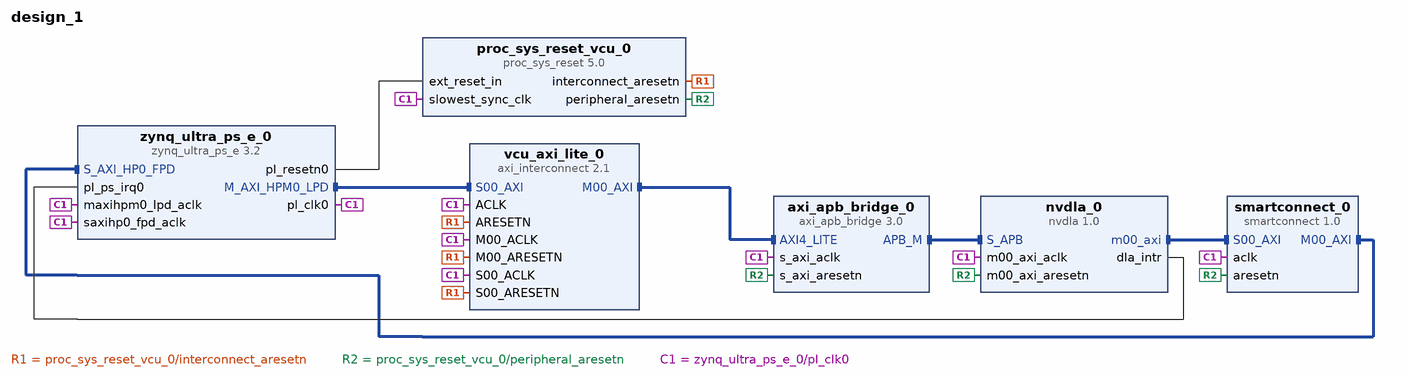
[diagram p0: block diagram of the top level]
# Vivado block design design_1, xczu7ev-ffvc1156-2-e, Vivado 2018.2
create_bd_design design_1

create_bd_cell -type ip -vlnv xilinx.com:ip:zynq_ultra_ps_e:3.2 zynq_ultra_ps_e_0
set_property -dict [list \
  CONFIG.PSU__I2C0__PERIPHERAL__ENABLE 1 \
  CONFIG.PSU__I2C0__PERIPHERAL__IO {MIO 2 .. 3} \
  CONFIG.PSU__SD0__PERIPHERAL__ENABLE 1 \
  CONFIG.PSU__SD0__PERIPHERAL__IO {MIO 13 .. 22} \
  CONFIG.PSU__SD0__SLOT_TYPE {SD 3.0} \
  CONFIG.PSU__SD0__DATA_TRANSFER_MODE 8Bit \
  CONFIG.PSU__UART0__BAUD_RATE 115200 \
  CONFIG.PSU__UART0__PERIPHERAL__ENABLE 1 \
  CONFIG.PSU__UART0__PERIPHERAL__IO {MIO 6 .. 7} \
  CONFIG.PSU__UART0__MODEM__ENABLE 0 \
  CONFIG.PSU__USE__S_AXI_GP2 1 \
  CONFIG.PSU__USE__IRQ0 1 \
  CONFIG.PSU__DDR_HIGH_ADDRESS_GUI_ENABLE 0 \
  CONFIG.PSU__DLL__ISUSED 1 \
] [get_bd_cells zynq_ultra_ps_e_0]
# 41 more settings of zynq_ultra_ps_e_0 are not shown: defaults, MIO pin electricals, DDR timing, and values the tool derives
create_bd_cell -type ip -vlnv xilinx.com:ip:axi_apb_bridge:3.0 axi_apb_bridge_0
set_property -dict {CONFIG.C_M_APB_PROTOCOL apb4 CONFIG.C_APB_NUM_SLAVES 1} [get_bd_cells axi_apb_bridge_0]
create_bd_cell -type ip -vlnv xilinx.com:ip:proc_sys_reset:5.0 proc_sys_reset_vcu_0
create_bd_cell -type ip -vlnv xilinx.com:ip:axi_interconnect:2.1 vcu_axi_lite_0
set_property -dict {CONFIG.NUM_MI 1} [get_bd_cells vcu_axi_lite_0]
create_bd_cell -type ip -vlnv user.org:user:nvdla:1.0 nvdla_0
set_property -dict {CONFIG.C_M00_AXI_BURST_LEN 16 CONFIG.C_M00_AXI_ID_WIDTH 1} [get_bd_cells nvdla_0]
create_bd_cell -type ip -vlnv xilinx.com:ip:smartconnect:1.0 smartconnect_0

# ---- connections ----

connect_bd_intf_net -intf_net axi_lite_2_zynq [get_bd_intf_pins zynq_ultra_ps_e_0/M_AXI_HPM0_LPD] [get_bd_intf_pins vcu_axi_lite_0/S00_AXI]
connect_bd_intf_net [get_bd_intf_pins vcu_axi_lite_0/M00_AXI] [get_bd_intf_pins axi_apb_bridge_0/AXI4_LITE]
connect_bd_intf_net [get_bd_intf_pins axi_apb_bridge_0/APB_M] [get_bd_intf_pins nvdla_0/S_APB]
connect_bd_intf_net [get_bd_intf_pins nvdla_0/m00_axi] [get_bd_intf_pins smartconnect_0/S00_AXI]
connect_bd_intf_net [get_bd_intf_pins smartconnect_0/M00_AXI] [get_bd_intf_pins zynq_ultra_ps_e_0/S_AXI_HP0_FPD]
connect_bd_net -net pl_reset_axi [get_bd_pins zynq_ultra_ps_e_0/pl_resetn0] [get_bd_pins proc_sys_reset_vcu_0/ext_reset_in]
connect_bd_net -net axi_lite_reset_10 [get_bd_pins proc_sys_reset_vcu_0/interconnect_aresetn] \
  [get_bd_pins vcu_axi_lite_0/ARESETN] [get_bd_pins vcu_axi_lite_0/S00_ARESETN] [get_bd_pins vcu_axi_lite_0/M00_ARESETN]
connect_bd_net [get_bd_pins proc_sys_reset_vcu_0/peripheral_aresetn] \
  [get_bd_pins axi_apb_bridge_0/s_axi_aresetn] [get_bd_pins nvdla_0/m00_axi_aresetn] [get_bd_pins smartconnect_0/aresetn]
connect_bd_net [get_bd_pins nvdla_0/dla_intr] [get_bd_pins zynq_ultra_ps_e_0/pl_ps_irq0]
connect_bd_net [get_bd_pins zynq_ultra_ps_e_0/pl_clk0] \
  [get_bd_pins zynq_ultra_ps_e_0/maxihpm0_lpd_aclk] [get_bd_pins vcu_axi_lite_0/S00_ACLK] \
  [get_bd_pins zynq_ultra_ps_e_0/saxihp0_fpd_aclk] [get_bd_pins smartconnect_0/aclk] \
  [get_bd_pins axi_apb_bridge_0/s_axi_aclk] [get_bd_pins vcu_axi_lite_0/M00_ACLK] \
  [get_bd_pins proc_sys_reset_vcu_0/slowest_sync_clk] [get_bd_pins vcu_axi_lite_0/ACLK] [get_bd_pins nvdla_0/m00_axi_aclk]

# ---- address map ----
assign_bd_address -offset 0x00000000 -range 2G -target_address_space [get_bd_addr_spaces nvdla_0/m00_axi] [get_bd_addr_segs zynq_ultra_ps_e_0/SAXIGP2/HP0_DDR_LOW]
assign_bd_address -offset 0xFF000000 -range 16M -target_address_space [get_bd_addr_spaces nvdla_0/m00_axi] [get_bd_addr_segs zynq_ultra_ps_e_0/SAXIGP2/HP0_LPS_OCM]
assign_bd_address -offset 0x00080000000 -range 64K -target_address_space [get_bd_addr_spaces zynq_ultra_ps_e_0/Data] [get_bd_addr_segs nvdla_0/S_APB/Reg]

validate_bd_design
save_bd_design
